# Altium schematic sheet CAN_Connections.SchDoc
size A
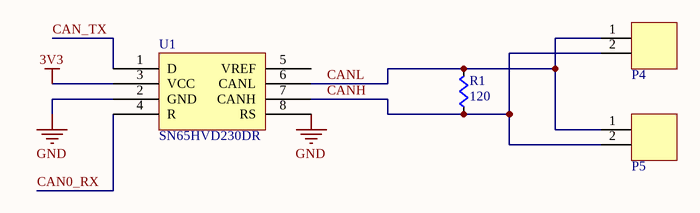
[diagram p0: CAN_Connections.SchDoc]

## Parts
P4  2-pin Horz Sherlock  [MOLEX-HDR-1X2-SHERLOCK-HORZ]  (value not drawn)
P5  2-pin Horz Sherlock  [MOLEX-HDR-1X2-SHERLOCK-HORZ]  (value not drawn)
R1  value 120  [RES0603]  (hidden comment: Res)
U1  SN65HVD230DR  [SOIC-8pin]

## Nets
3V3: U1.3(VCC)
GND: U1.2(GND) U1.8(RS)
CAN0_RX: U1.4(R)
CAN_TX: U1.1(D)
CANH: P4.2 P5.2 R1.2(B) U1.7(CANH)
CANL: P4.1 P5.1 R1.1(A) U1.6(CANL)

Not connected (* = marked no-connect by the designer): U1 5(VREF)

## Library data of the parts
P4 P5 = MOLEX-HDR-1x2-SHERLOCK_RA: Header, Molex, 2mm Pitch Sherlock Header, Single Row, Horizontal, 2 Circuits, Length 3.3mm,  0353630260; Manufacturer: Molex Inc; Manufacturer Part Number: 0353630260; Supplier Part Number 1: WM18931-ND; Supplier 1: Digi-Key
U1 = SN65HVD230DR: IC TXRX CAN 1MBPS 3.3V 8SOIC; Supplier 1: Digi-Key; Supplier Part Numbe 1: 296-11654-1-ND
R1 = Res: Supplier 1: Digi-Key; Supplier Part Number 1: RMCF0603JT10K0CT-ND